# Altium schematic sheet SDRAM_hall_crossboard_1_1.SchDoc
size A4
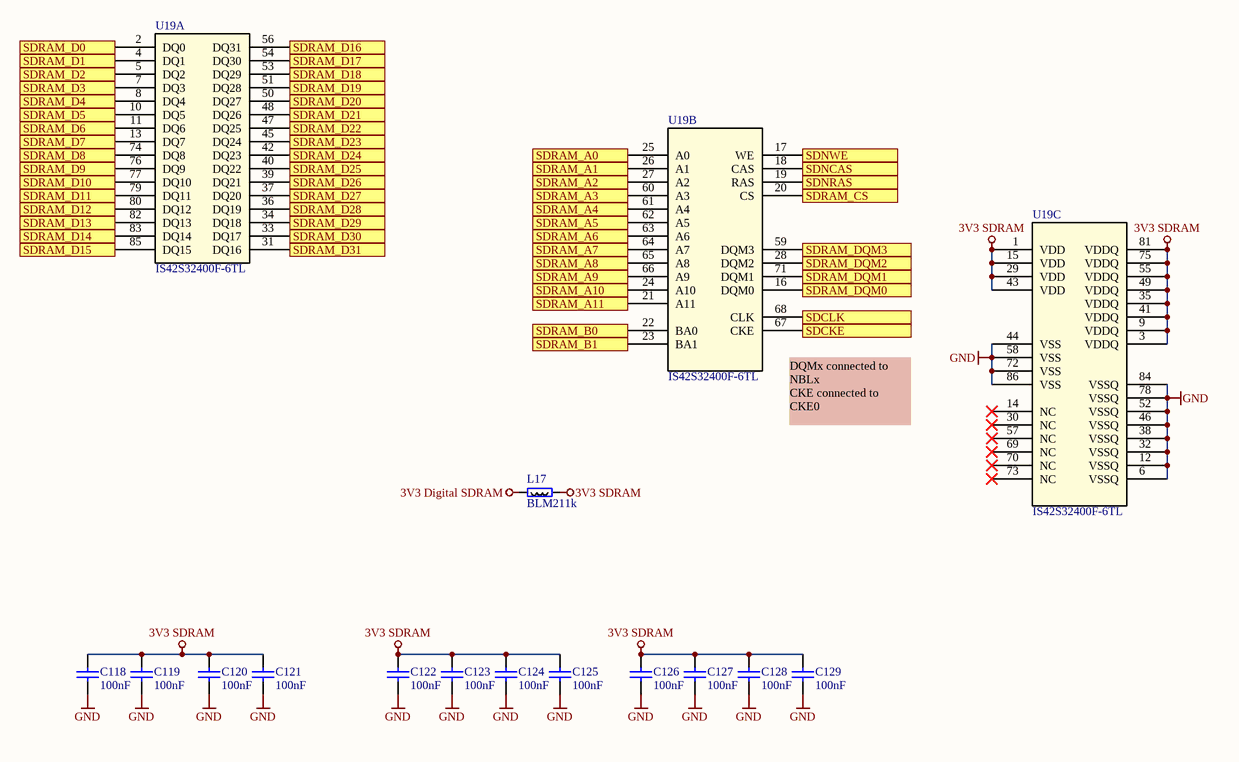
[diagram p0: SDRAM_hall_crossboard_1_1.SchDoc]

## Parts
C118  100nF  [0603C]
C119  100nF  [0603C]
C120  100nF  [0603C]
C121  100nF  [0603C]
C122  100nF  [0603C]
C123  100nF  [0603C]
C124  100nF  [0603C]
C125  100nF  [0603C]
C126  100nF  [0603C]
C127  100nF  [0603C]
C128  100nF  [0603C]
C129  100nF  [0603C]
L17  BLM211k  [RESC2012X50N]
U19  IS42S32400F-6TL  [SOP50P1176X120-86N]  (parts A,B,C of 3)

## Ports
SDCKE, SDCLK, SDNCAS, SDNRAS, SDNWE, SDRAM_A0, SDRAM_A1, SDRAM_A2, SDRAM_A3, SDRAM_A4, SDRAM_A5, SDRAM_A6, SDRAM_A7, SDRAM_A8, SDRAM_A9, SDRAM_A10, SDRAM_A11, SDRAM_B0, SDRAM_B1, SDRAM_CS, SDRAM_D0, SDRAM_D1, SDRAM_D2, SDRAM_D3, SDRAM_D4, SDRAM_D5, SDRAM_D6, SDRAM_D7, SDRAM_D8, SDRAM_D9, SDRAM_D10, SDRAM_D11, SDRAM_D12, SDRAM_D13, SDRAM_D14, SDRAM_D15, SDRAM_D16, SDRAM_D17, SDRAM_D18, SDRAM_D19, SDRAM_D20, SDRAM_D21, SDRAM_D22, SDRAM_D23, SDRAM_D24, SDRAM_D25, SDRAM_D26, SDRAM_D27, SDRAM_D28, SDRAM_D29, SDRAM_D30, SDRAM_D31, SDRAM_DQM0, SDRAM_DQM1, SDRAM_DQM2, SDRAM_DQM3

## Nets
3V3 Digital SDRAM: L17.1
3V3 SDRAM: C118.2 C119.2 C120.2 C121.2 C122.2 C123.2 C124.2 C125.2 C126.2 C127.2 C128.2 C129.1 L17.2 U19.1(VDD) U19.3(VDDQ) U19.9(VDDQ) U19.15(VDD) U19.29(VDD) U19.35(VDDQ) U19.41(VDDQ) U19.43(VDD) U19.49(VDDQ) U19.55(VDDQ) U19.75(VDDQ) U19.81(VDDQ)
GND: C118.1 C119.1 C120.1 C121.1 C122.1 C123.1 C124.1 C125.1 C126.1 C127.1 C128.1 C129.2 U19.6(VSSQ) U19.12(VSSQ) U19.32(VSSQ) U19.38(VSSQ) U19.44(VSS) U19.46(VSSQ) U19.52(VSSQ) U19.58(VSS) U19.72(VSS) U19.78(VSSQ) U19.84(VSSQ) U19.86(VSS)
SDCKE: U19.67(CKE) ; port SDCKE
SDCLK: U19.68(CLK) ; port SDCLK
SDNCAS: U19.18(CAS) ; port SDNCAS
SDNRAS: U19.19(RAS) ; port SDNRAS
SDNWE: U19.17(WE) ; port SDNWE
SDRAM_A0: U19.25(A0) ; port SDRAM_A0
SDRAM_A1: U19.26(A1) ; port SDRAM_A1
SDRAM_A2: U19.27(A2) ; port SDRAM_A2
SDRAM_A3: U19.60(A3) ; port SDRAM_A3
SDRAM_A4: U19.61(A4) ; port SDRAM_A4
SDRAM_A5: U19.62(A5) ; port SDRAM_A5
SDRAM_A6: U19.63(A6) ; port SDRAM_A6
SDRAM_A7: U19.64(A7) ; port SDRAM_A7
SDRAM_A8: U19.65(A8) ; port SDRAM_A8
SDRAM_A9: U19.66(A9) ; port SDRAM_A9
SDRAM_A10: U19.24(A10) ; port SDRAM_A10
SDRAM_A11: U19.21(A11) ; port SDRAM_A11
SDRAM_B0: U19.22(BA0) ; port SDRAM_B0
SDRAM_B1: U19.23(BA1) ; port SDRAM_B1
SDRAM_CS: U19.20(CS) ; port SDRAM_CS
SDRAM_D0: U19.2(DQ0) ; port SDRAM_D0
SDRAM_D1: U19.4(DQ1) ; port SDRAM_D1
SDRAM_D2: U19.5(DQ2) ; port SDRAM_D2
SDRAM_D3: U19.7(DQ3) ; port SDRAM_D3
SDRAM_D4: U19.8(DQ4) ; port SDRAM_D4
SDRAM_D5: U19.10(DQ5) ; port SDRAM_D5
SDRAM_D6: U19.11(DQ6) ; port SDRAM_D6
SDRAM_D7: U19.13(DQ7) ; port SDRAM_D7
SDRAM_D8: U19.74(DQ8) ; port SDRAM_D8
SDRAM_D9: U19.76(DQ9) ; port SDRAM_D9
SDRAM_D10: U19.77(DQ10) ; port SDRAM_D10
SDRAM_D11: U19.79(DQ11) ; port SDRAM_D11
SDRAM_D12: U19.80(DQ12) ; port SDRAM_D12
SDRAM_D13: U19.82(DQ13) ; port SDRAM_D13
SDRAM_D14: U19.83(DQ14) ; port SDRAM_D14
SDRAM_D15: U19.85(DQ15) ; port SDRAM_D15
SDRAM_D16: U19.56(DQ31) ; port SDRAM_D16
SDRAM_D17: U19.54(DQ30) ; port SDRAM_D17
SDRAM_D18: U19.53(DQ29) ; port SDRAM_D18
SDRAM_D19: U19.51(DQ28) ; port SDRAM_D19
SDRAM_D20: U19.50(DQ27) ; port SDRAM_D20
SDRAM_D21: U19.48(DQ26) ; port SDRAM_D21
SDRAM_D22: U19.47(DQ25) ; port SDRAM_D22
SDRAM_D23: U19.45(DQ24) ; port SDRAM_D23
SDRAM_D24: U19.42(DQ23) ; port SDRAM_D24
SDRAM_D25: U19.40(DQ22) ; port SDRAM_D25
SDRAM_D26: U19.39(DQ21) ; port SDRAM_D26
SDRAM_D27: U19.37(DQ20) ; port SDRAM_D27
SDRAM_D28: U19.36(DQ19) ; port SDRAM_D28
SDRAM_D29: U19.34(DQ18) ; port SDRAM_D29
SDRAM_D30: U19.33(DQ17) ; port SDRAM_D30
SDRAM_D31: U19.31(DQ16) ; port SDRAM_D31
SDRAM_DQM0: U19.16(DQM0) ; port SDRAM_DQM0
SDRAM_DQM1: U19.71(DQM1) ; port SDRAM_DQM1
SDRAM_DQM2: U19.28(DQM2) ; port SDRAM_DQM2
SDRAM_DQM3: U19.59(DQM3) ; port SDRAM_DQM3

Not connected (* = marked no-connect by the designer): U19 14(NC)* 30(NC)* 57(NC)* 69(NC)* 70(NC)* 73(NC)*

## Notes on the sheet
- (near U19) DQMx connected to NBLx
  CKE connected to CKE0

## Library data of the parts
C118-C129 = Capacitor_ST: Capacitor 0402 / 0603 / 0805; Revision: July-2002: Re-released for DXP Platform.; Value: 100nF
L17 = BLM21: SMD Ferrite bead 0805; Vendor: Vishay; Value: 1k; Pkg: SMD0805; SMD Solders: 2; Solder Option: RM; Device: BLM21; Price: 10
U19 = IS42S32400F/IS45S32400F: 4M x 32 / 128Mb SYNCHRONOUS DRAM